# Altium schematic sheet Headers.SchDoc
size A
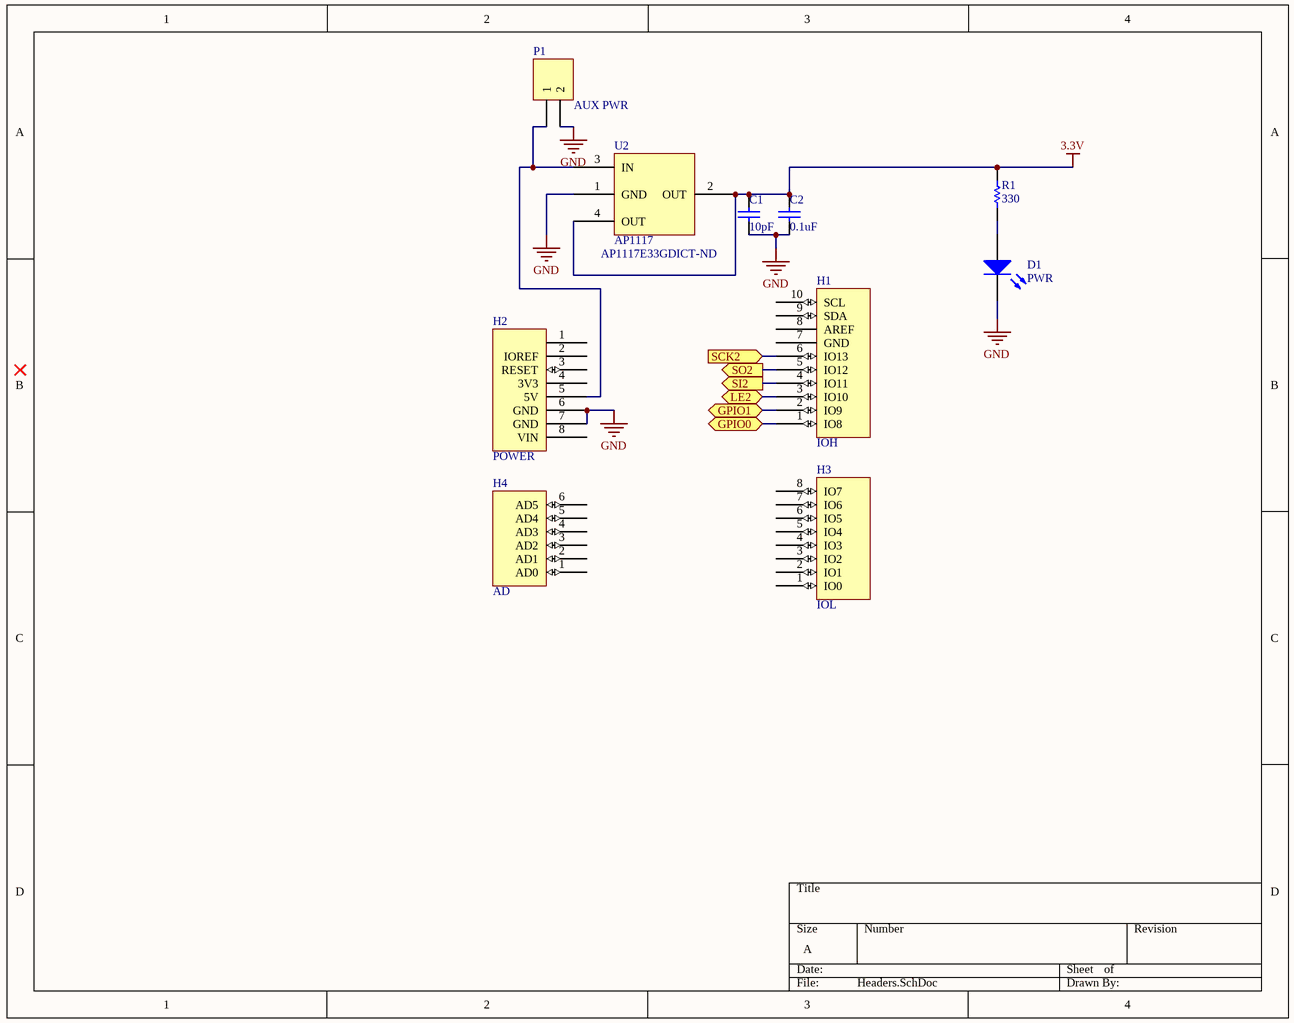
[diagram p0: Headers.SchDoc]

## Parts
C1  value 10pF  [0402]  (hidden comment: Cap Semi)
C2  value 0.1uF  [0402]  (hidden comment: Cap Semi)
D1  PWR  [0603]
H1  IOH  [Header 10x1 8.5mm]
H2  POWER  [Header 8x1 8.5mm]
H3  IOL  [Header 8x1 8.5mm]
H4  AD  [Header 6x1 8.5mm]
P1  AUX PWR  [HDR1X2]
R1  value 330  [0402]  (hidden comment: Res Semi)
U2  AP1117

## Ports
GPIO0, GPIO1, LE2, SCK2 (in), SI2 (out), SO2 (out)

## Nets
3.3V: C1.1 C2.1 R1.2 U2.2(OUT) U2.4(OUT)
GND: C1.2 C2.2 D1.2(K) H2.6(GND) H2.7(GND) P1.2 U2.1(GND)
GPIO0: H1.1(IO8) ; port GPIO0
GPIO1: H1.2(IO9) ; port GPIO1
LE2: H1.3(IO10) ; port LE2
SCK2: H1.6(IO13) ; port SCK2
SI2: H1.4(IO11) ; port SI2
SO2: H1.5(IO12) ; port SO2
NetD1_1: D1.1(A) R1.1
NetH2_5: H2.5(5V) P1.1 U2.3(IN)

Not connected (* = marked no-connect by the designer): H1 7(GND) 8(AREF) 9(SDA) 10(SCL); H2 1 2(IOREF) 3(RESET) 4(3V3) 8(VIN); H3 1(IO0) 2(IO1) 3(IO2) 4(IO3) 5(IO4) 6(IO5) 7(IO6) 8(IO7); H4 1(AD0) 2(AD1) 3(AD2) 4(AD3) 5(AD4) 6(AD5)

## Notes on the sheet
- (near U2) AP1117E33GDICT-ND

## Library data of the parts
C1 C2 = Cap Semi: Capacitor (Semiconductor SIM Model); Published: 8-Jun-2000; LatestRevisionDate: 29-May-2009; LatestRevisionNote: IPC-7351 Footprint Added.; PackageReference: C1206; Publisher: Altium Limited; PackageDescription: Chip Capacitor
D1 = LED2: Typical RED, GREEN, YELLOW, AMBER GaAs LED; Published: 8-Jun-2000; LatestRevisionDate: 17-Jul-2002; LatestRevisionNote: Re-released for DXP Platform.; PackageVersion: Feb-2002; PackageReference: 3.2X1.6X1.1; Publisher: Altium Limited; PackageDescription: SM LED; 2 Flat Leads
P1 = Header 2: Header, 2-Pin; LatestRevisionDate: 17-Jul-2002; LatestRevisionNote: Re-released for DXP Platform.; Publisher: Altium Limited
R1 = Res Semi: Semiconductor Resistor; Published: 8-Jun-2000; LatestRevisionDate: 17-Jul-2002; LatestRevisionNote: Re-released for DXP Platform.; PackageReference: AXIAL-0.5; Publisher: Altium Limited; PackageDescription: Axial Device, Thru-Hole; 2 Leads; 0.5 in Pin Spacing